# Altium project PCB_ProjectV3.PrjPCB
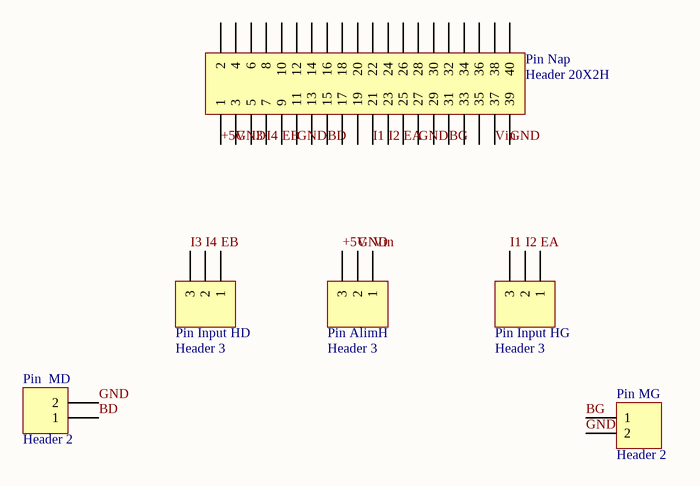
[diagram p0: PekeeCarte2.SchDoc]
1 sheet, 6 parts. Net scope: global (net labels, ports and power ports of the same name join across sheets).
Board files: PekeeCarte2.PcbDoc, PekeeCarte3.PcbDoc

## Sheet PekeeCarte2.SchDoc
size A4

### Parts
Pin_AlimH  Header 3  [HDR1X3]
Pin_Input_HD  Header 3  [HDR1X3]
Pin_Input_HG  Header 3  [HDR1X3]
Pin_MD  Header 2  [HDR1X2]
Pin_MG  Header 2  [HDR1X2]
Pin_Nap  Header 20X2H  [HDR2X20H]

### Nets
+5V: Pin_AlimH.3 Pin_Nap.1
BD: Pin_MD.1 Pin_Nap.15
BG: Pin_MG.1 Pin_Nap.31
EA: Pin_Input_HG.1 Pin_Nap.25
EB: Pin_Input_HD.1 Pin_Nap.9
GND: Pin_AlimH.2 Pin_MD.2 Pin_MG.2 Pin_Nap.3 Pin_Nap.11 Pin_Nap.27 Pin_Nap.39
I1: Pin_Input_HG.3 Pin_Nap.21
I2: Pin_Input_HG.2 Pin_Nap.23
I3: Pin_Input_HD.3 Pin_Nap.5
I4: Pin_Input_HD.2 Pin_Nap.7
Vin: Pin_AlimH.1 Pin_Nap.37

Not connected (* = marked no-connect by the designer): Pin_Nap 2 4 6 8 10 12 13 14 16 17 18 19 20 22 24 26 28 29 30 32 33 34 35 36 38 40

### Library data of the parts
Pin_AlimH Pin_Input_HD Pin_Input_HG = Header 3: Header, 3-Pin; LatestRevisionDate: 17-Jul-2002; LatestRevisionNote: Re-released for DXP Platform.; Publisher: Altium Limited
Pin_MD Pin_MG = Header 2: Header, 2-Pin; LatestRevisionDate: 17-Jul-2002; LatestRevisionNote: Re-released for DXP Platform.; Publisher: Altium Limited
Pin_Nap = Header 20X2H: Header, 20-Pin, Dual row, Right Angle; LatestRevisionDate: 17-Jul-2002; LatestRevisionNote: Re-released for DXP Platform.; Publisher: Altium Limited